# EAGLE design current_only (EAGLE 9.0.1)
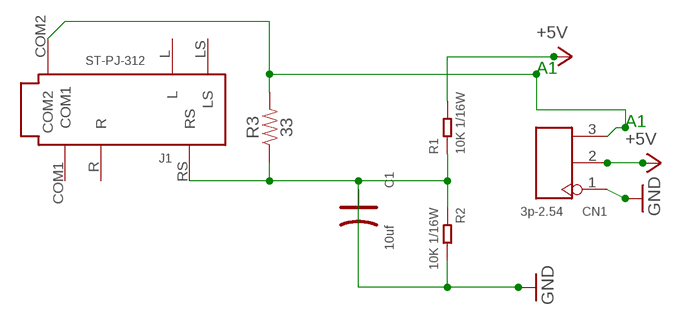
[diagram p0: schematic, sheet 1]

## Parts
C1  10uf  TANTALUM-SMD-10UF-10V-10%(AVX-A)  [AVX-A]
CN1  3p-2.54  DIP-BLACK-MALE-HEADER-VERT(3P-2.54)  [H3-2.54]
J1  ST-PJ-312  AUDIO-JACK-6P-SMD(ST-PJ-312)  [AUDIO6P-SMD-3.5-14.0X6.4X5.0MM]
R1  10K 1/16W  SMD-RES-10K-1%-1/16W(0402)  [R0402]
R2  10K 1/16W  SMD-RES-10K-1%-1/16W(0402)  [R0402]
R3  33  33OHM-0603-1/10W-1%  [0603]

## Nets
+5V: CN1.2 R1.2
GND: C1.+ CN1.1 R2.2
N$1: C1.- J1.RS R1.1 R2.1 R3.1
N$2: CN1.3 J1.COM2 R3.2
Unconnected: J1.COM1 J1.L J1.LS J1.R

## Notes on the sheet
- A1
- A1

## Library data of the parts
C1 = Seeed-Capacitor:TANTALUM-SMD-10UF-10V-10%(AVX-A): 302020011; MPN: TAJA106K010RNJ
CN1 = Seeed-Connector:DIP-BLACK-MALE-HEADER-VERT(3P-2.54): 320020079
J1 = Seeed-Connector:AUDIO-JACK-6P-SMD(ST-PJ-312): 320040007; MPN: ST-PJ-312
R1 R2 = Seeed-Resistor:SMD-RES-10K-1%-1/16W(0402): 301010047; MPN: RC0402FR-0710KL
R3 = SparkFun-Resistors:33OHM: 33Ω resistor A resistor is a passive two-terminal electrical component that implements electrical resistance as a circuit element. Resistors act to reduce current flow, and, at the same time, act to lower voltage levels within circuits. - Wikipedia; PROD_ID: RES-08270

## Board
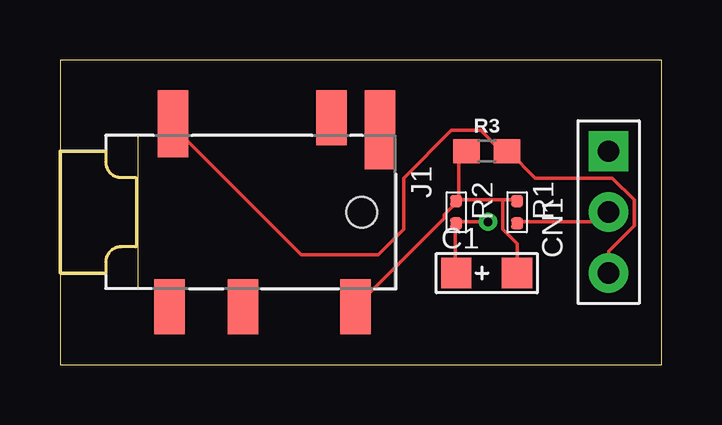
[diagram p1: board, top side]
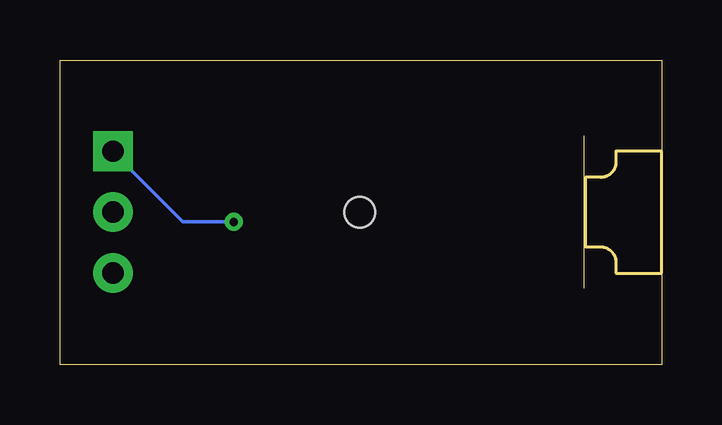
[diagram p2: board, bottom side, seen from below]

Size 25.07 x 12.69 mm. Coordinates in mm from the lower left corner, seen from the top.
Outline: 0,0 25.07,0 25.07,12.69 0,12.69 0,0
Copper layers (1*16): Top 0.035mm / dielectric 1.5mm / Bottom 0.035mm
Design rules "default": minimum track width 6mil, minimum drill 0.35mm, track to track 6mil, track to pad 6mil, pad to pad 6mil, via to via 6mil, smd to smd 6mil, copper to edge 40mil, drill to drill 6mil, minimum pad ring 10mil, minimum via ring 8mil, stop-mask expansion 4mil, vias tented up to drill 0mil, thermal gap 10mil

### Footprints (pad centres in the part's own frame; a part is rotated, then mirrored left to right if it is on the bottom)
AVX-A = smd 1.27 x 1.27: + -1.27,0; - 1.27,0
H3-2.54 = drill 0.889 pad 1.651 square: 1 0,2.54 | drill 0.889 pad 1.651: 2 0,0; 3 0,-2.54
AUDIO6P-SMD-3.5-14.0X6.4X5.0MM = smd 1.27 x 2.286: COM1 -4.572,3.937; L -11.303,-3.937; R -7.62,3.937; RS -12.319,3.937 | smd 1.27 x 2.794: COM2 -4.699,-3.683 | smd 1.27 x 3.302: LS -13.335,-3.429 | hole 1.27: -12.573,0
R0402 = smd 0.5 x 0.5: 1 0,0.463; 2 0,-0.463
0603 = smd 1.1 x 1: 1 -0.85,0; 2 0.85,0

### Placement (x,y rotation side)
C1  17.78,3.81 0 top
CN1  22.86,6.35 0 top
J1  0,6.35 180 top
R1  19.05,6.35 0 top
R2  16.51,6.35 0 top
R3  17.78,8.89 0 top

### Tracks (layer width: path | path; a pad name or v marks a point on that pad's centre or on a via)
+5V
  Top 0.152: R1.2 19.05,5.94 22.55,5.94 22.86,6.25 CN1.2
GND  (via drill 0.35)
  Top 0.152: C1.+ 16.46,3.81 16.46,5.79 R2.2 16.61,5.94 v17.83,5.94
  Bottom 0.152: v17.83,5.94 19.96,5.94 22.86,8.84 CN1.1
N$1
  Top 0.152: 16.61,6.86 16.61,8.53 16.92,8.84 R3.1 | 16.61,6.86 18.44,6.86 | 18.44,6.86 19.05,6.86 R1.1 | 16.61,6.86 R2.1 16.46,6.71 16,6.25 16,6.1 J1.RS | C1.- 19.05,5.03 18.44,5.64 18.44,6.86
N$2
  Top 0.152: J1.COM2 4.72,9.91 10.06,4.57 13.26,4.57 14.33,5.64 14.33,7.77 16.31,9.75 17.53,9.75 18.29,8.99 18.59,8.99 R3.2 18.75,8.84 19.81,7.77 23.01,7.77 23.93,6.86 23.93,5.79 22.86,4.72 CN1.3